# EAGLE design tenka1 (EAGLE 6.5.0)
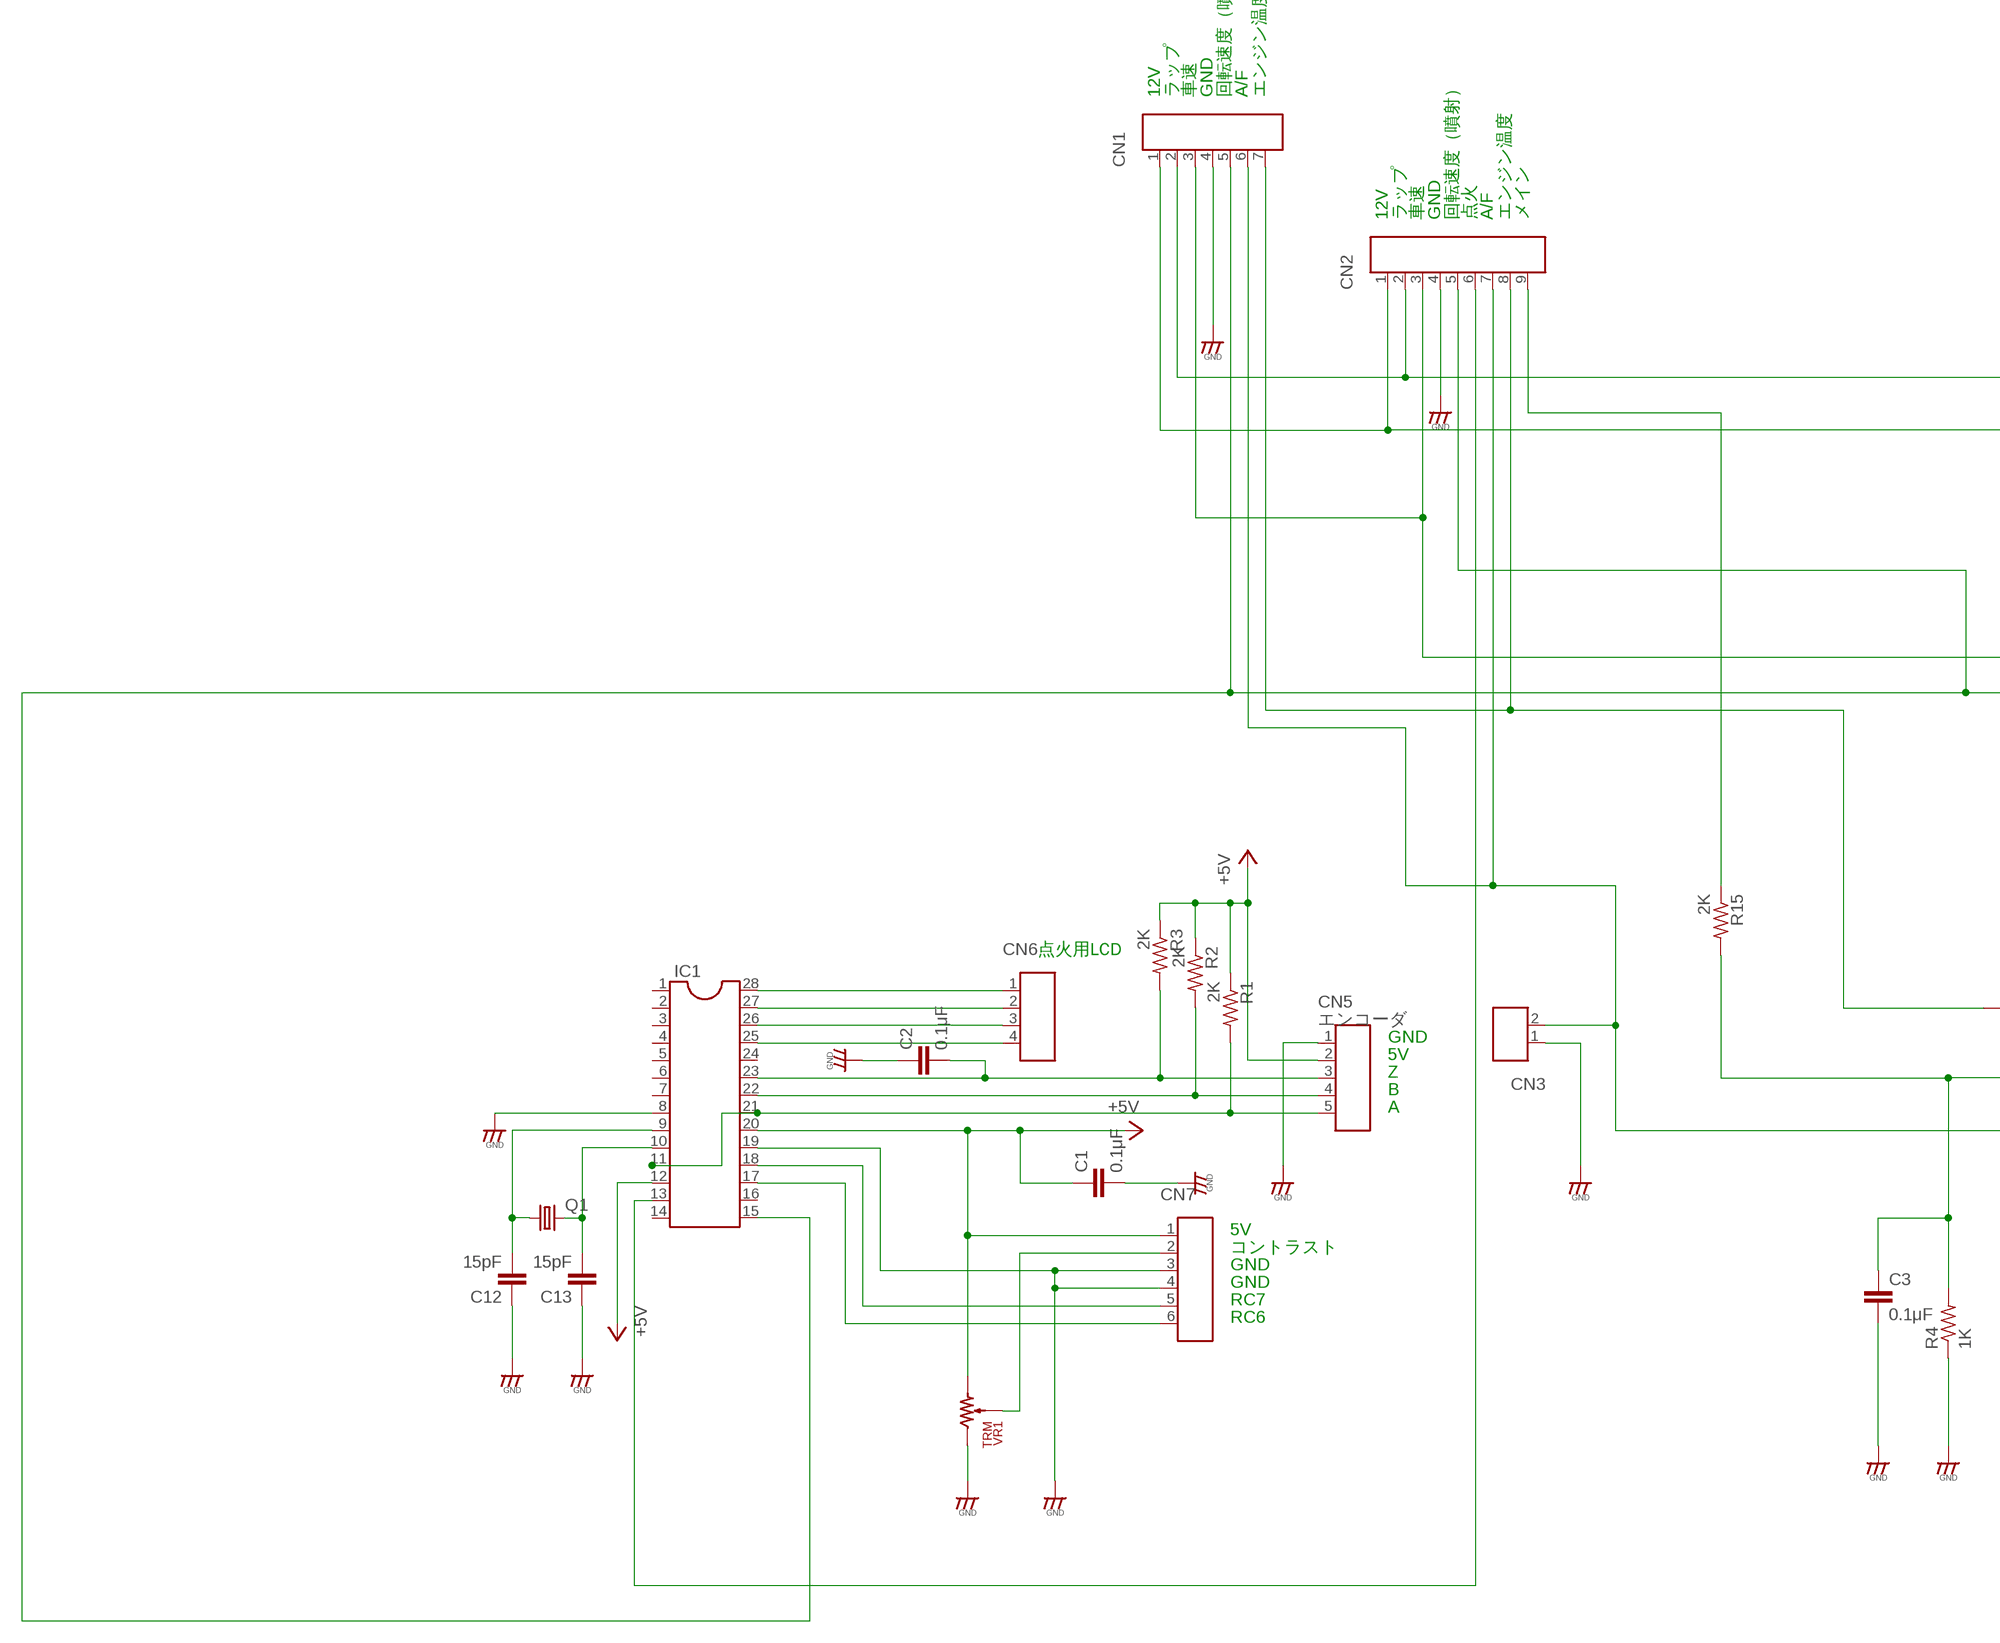
[diagram p0: schematic, sheet 1, part 1 of 2]
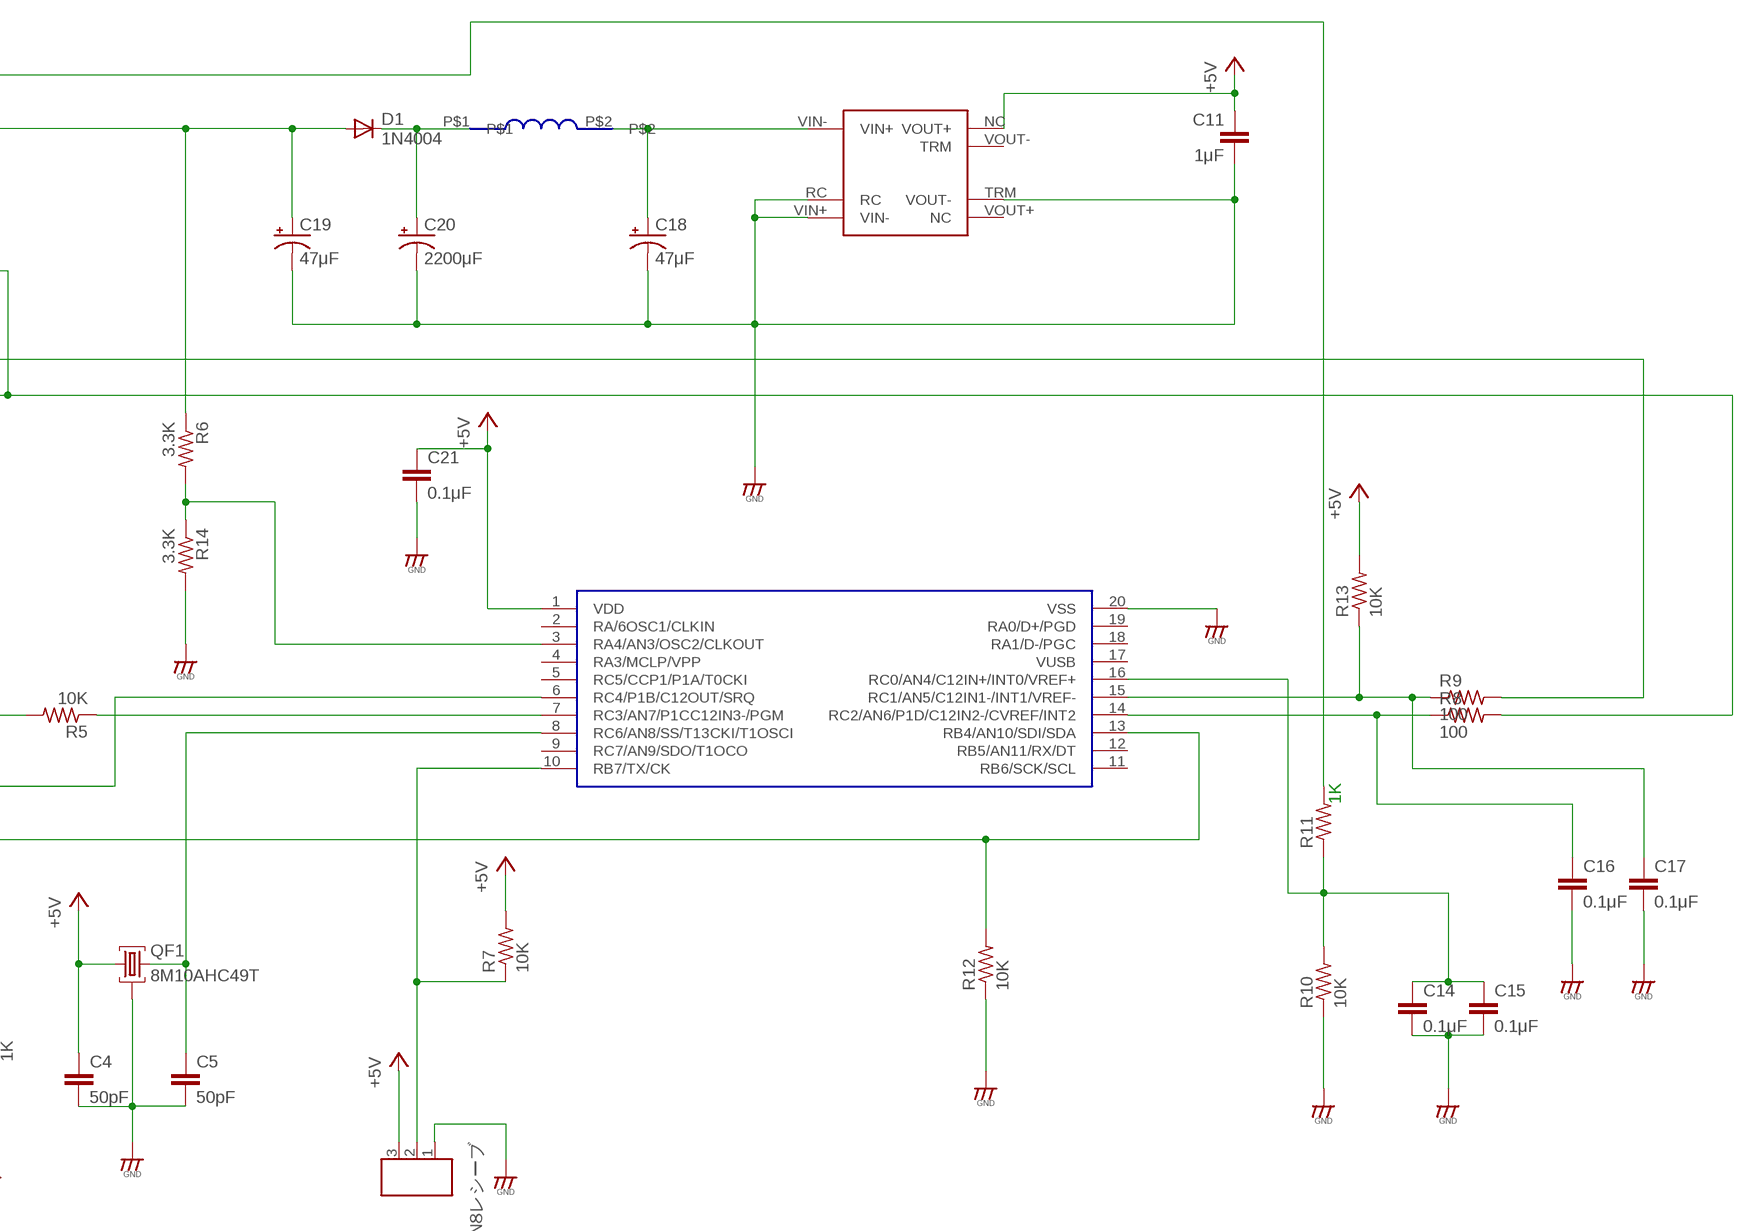
[diagram p1: schematic, sheet 1, part 2 of 2]

## Parts
18F14K50  18F14K5018F14K50  [18F14K50]
C1  0.1μF  C-EU025-024X044  [C025-024X044]
C2  0.1μF  C-EU025-024X044  [C025-024X044]
C3  0.1μF  C-EU025-024X044  [C025-024X044]
C4  50pF  C-EU025-024X044  [C025-024X044]
C5  50pF  C-EU025-024X044  [C025-024X044]
C11  1μF  C-EU025-024X044  [C025-024X044]
C12  15pF  C-EU025-024X044  [C025-024X044]
C13  15pF  C-EU025-024X044  [C025-024X044]
C14  0.1μF  C-EU025-024X044  [C025-024X044]
C15  0.1μF  C-EU025-024X044  [C025-024X044]
C16  0.1μF  C-EU025-024X044  [C025-024X044]
C17  0.1μF  C-EU025-024X044  [C025-024X044]
C18  47μF  CPOL-USE2-4  [E2-4]
C19  47μF  CPOL-USE2-4  [E2-4]
C20  2200μF  CPOL-USE5-13  [E5-13]
C21  0.1μF  C-EU025-024X044  [C025-024X044]
CN1  CON_7P  [CON_HRS_DIP_7]
CN2  CON_9P  [CON_HRS_DIP_9]
CN3  CON_2P  [CON_HRS_DIP_2]
CN5  エンコーダ  CON_5P  [CON_HRS_DIP_5]
CN6  CON_4P  [CON_HRS_DIP_4]
CN7  CON_6P  [CON_HRS_DIP_6]
CN8レシーブ  CON_3P  [CON_HRS_DIP_3]
D1  1N4004  [DO41-10]
DC2  DCDC_NEW  [DCDC_NEW]
IC1  DIL28-3  [DIL28-3]
LHL13NB101K1  LHL13NB101KLHL13NB101K  [LHL13NB101K]
Q1  CRYSTALHC49S  [HC49/S]
QF1  8M10AHC49T  [HC49U]
R1  2K  R-US_0207/7  [0207/7]
R2  2K  R-US_0207/7  [0207/7]
R3  2K  R-US_0207/7  [0207/7]
R4  1K  R-US_0207/7  [0207/7]
R5  10K  R-US_0207/7  [0207/7]
R6  3.3K  R-US_0207/7  [0207/7]
R7  10K  R-US_0207/7  [0207/7]
R8  100  R-US_0207/7  [0207/7]
R9  100  R-US_0207/7  [0207/7]
R10  10K  R-US_0207/7  [0207/7]
R11  R-US_0207/7  [0207/7]
R12  10K  R-US_0207/7  [0207/7]
R13  10K  R-US_0207/7  [0207/7]
R14  3.3K  R-US_0207/7  [0207/7]
R15  2K  R-US_0207/7  [0207/7]
VR1  TRM  [TRM]

## Nets
+5V: 18F14K50.1(VDD) C1.1 C4.1 C11.1 C21.1 CN5.2 CN7.1 CN8レシーブ.3 DC2.NC(VOUT+) IC1.12 IC1.20 QF1.1 R1.1 R2.1 R3.1 R7.2 R13.2 VR1.P$1
N$1: CN5.5 IC1.11 IC1.21 R1.2
N$2: CN2.9 R15.1
N$4: CN6.1 IC1.28
N$5: CN6.2 IC1.27
N$7: CN5.4 IC1.22 R2.2
N$9: C13.2 IC1.10 Q1.2
N$10: C12.2 IC1.9 Q1.1
N$11: CN7.5 IC1.18
N$12: CN6.3 IC1.26
N$13: CN6.4 IC1.25
N$14: CN7.6 IC1.17
N$15: CN7.2 VR1.P$2
N$16: CN1.7 CN2.8 R5.2
N$17: CN2.6 IC1.13
N$18: 18F14K50.13(RB4/AN10/SDI/SDA) CN1.6 CN2.7 CN3.2 R12.2
N$19: 18F14K50.7(RC3/AN7/P1CC12IN3-/PGM) R5.1
N$20: 18F14K50.10(RB7/TX/CK) CN8レシーブ.2 R7.1
N$21: CN1.5 CN2.5 IC1.15 R8.2
N$22: 18F14K50.8(RC6/AN8/SS/T13CKI/T1OSCI) C5.1 QF1.3
N$23: 18F14K50.6(RC4/P1B/C12OUT/SRQ) C3.1 R4.2 R15.2
N$24: CN1.3 CN2.3 R9.2
N$25: 18F14K50.15(RC1/AN5/C12IN1-/INT1/VREF-) C17.1 R9.1 R13.1
N$26: 18F14K50.14(RC2/AN6/P1D/C12IN2-/CVREF/INT2) C16.1 R8.1
N$27: 18F14K50.16(RC0/AN4/C12IN+/INT0/VREF+) C14.1 C15.1 R10.2 R11.1
N$28: 18F14K50.3(RA4/AN3/OSC2/CLKOUT) R6.2 R14.1
N$30: C18.+ DC2.VIN-(VIN+) LHL13NB101K1.P$2
N$31: CN1.2 CN2.2 R11.2
N$32: C20.+ D1.C LHL13NB101K1.P$1
N$33: C19.+ CN1.1 CN2.1 D1.A R6.1
N$79: 18F14K50.20(VSS) C1.2 C2.1 C3.2 C4.2 C5.2 C11.2 C12.1 C13.1 C14.2 C15.2 C16.2 C17.2 C18.- C19.- C20.- C21.2 CN1.4 CN2.4 CN3.1 CN5.1 CN7.3 CN7.4 CN8レシーブ.1 DC2.RC DC2.TRM(VOUT-) DC2.VIN+(VIN-) IC1.8 IC1.19 QF1.2 R4.1 R10.1 R12.1 R14.2 VR1.P$3 ; supply symbol labelled GND
N$226: C2.2 CN5.3 IC1.23 R3.2
Unconnected: 18F14K50.2(RA/6OSC1/CLKIN) 18F14K50.4(RA3/MCLP/VPP) 18F14K50.5(RC5/CCP1/P1A/T0CKI) 18F14K50.9(RC7/AN9/SDO/T1OCO) 18F14K50.11(RB6/SCK/SCL) 18F14K50.12(RB5/AN11/RX/DT) 18F14K50.17(VUSB) 18F14K50.18(RA1/D-/PGC) 18F14K50.19(RA0/D+/PGD) DC2.VOUT+(NC) DC2.VOUT-(TRM) IC1.1 IC1.2 IC1.3 IC1.4 IC1.5 IC1.6 IC1.7 IC1.14 IC1.16 IC1.24

## Notes on the sheet
- 12V | ラップ | 車速 | GND | 回転速度（噴射） | A/F | エンジン温度
- 12V | ラップ | 車速 | GND | 回転速度（噴射） | 点火 | A/F | エンジン温度 | メイン
- 点火用LCD
- GND
- 5V
- Z
- B | 1K
- A
- 5V
- コントラスト
- GND
- GND
- RC7
- RC6

## Library data of the parts
18F14K50 = 18f14k50:18F14K50: 18f14k50
C1-C5 C11-C17 C21 = rcl:C-EU: CAPACITOR, European symbol
C18-C20 = rcl:CPOL-US: POLARIZED CAPACITOR, American symbol
CN1 = da_parts:CON_7P
CN2 = da_parts:CON_9P
CN3 = da_parts:CON_2P
CN5 = da_parts:CON_5P
CN6 = da_parts:CON_4P
CN7 = da_parts:CON_6P
CN8レシーブ = da_parts:CON_3P
D1 = diode:1N4004: DIODE general purpose rectifier, 1 A
DC2 = DCDC_NEWver:DCDC_NEW: DCDC_CONVERTER
IC1 = ic-package:DIL28: Dual In Line
LHL13NB101K1 = LHL13NB101K:LHL13NB101K: LHL13NB101K
Q1 = crystal:CRYSTAL: CRYSTAL; OC_FARNELL: 1667008; OC_NEWARK: unknown
QF1 = crystal:8M10AHC49T: Monolithic Crystal Filters Source: www.vanlong.com; OC_FARNELL: unknown; OC_NEWARK: unknown
R1-R15 = rcl:R-US_: RESISTOR, American symbol
VR1 = kitpcb:TRM

## Board
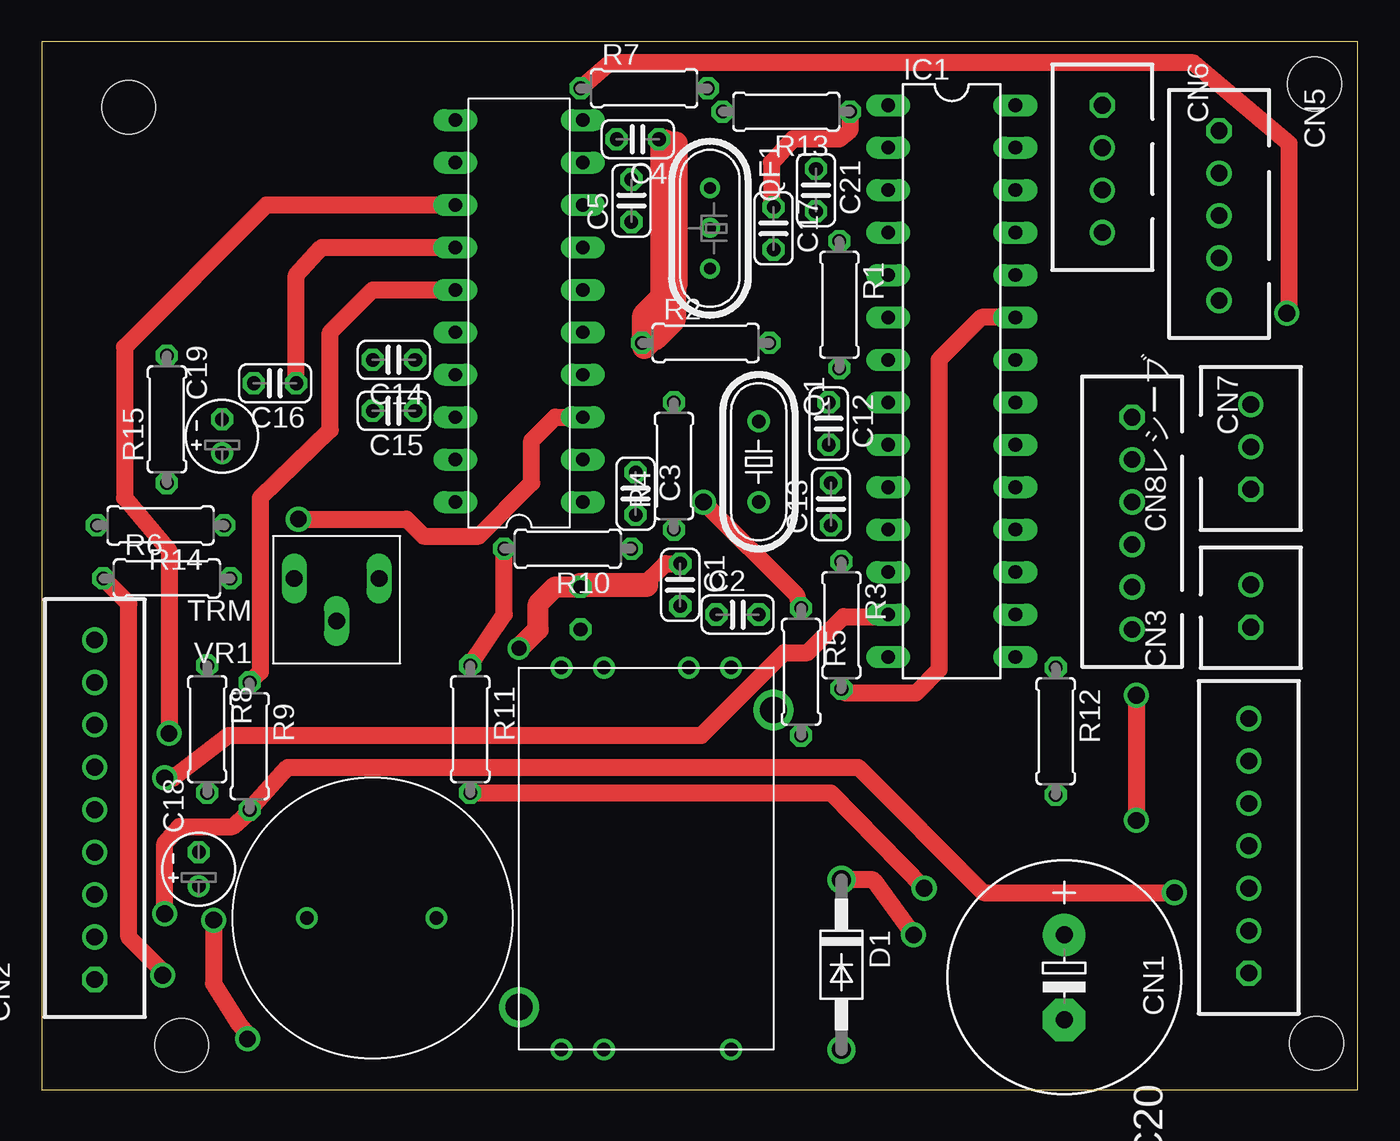
[diagram p2: board, top side]
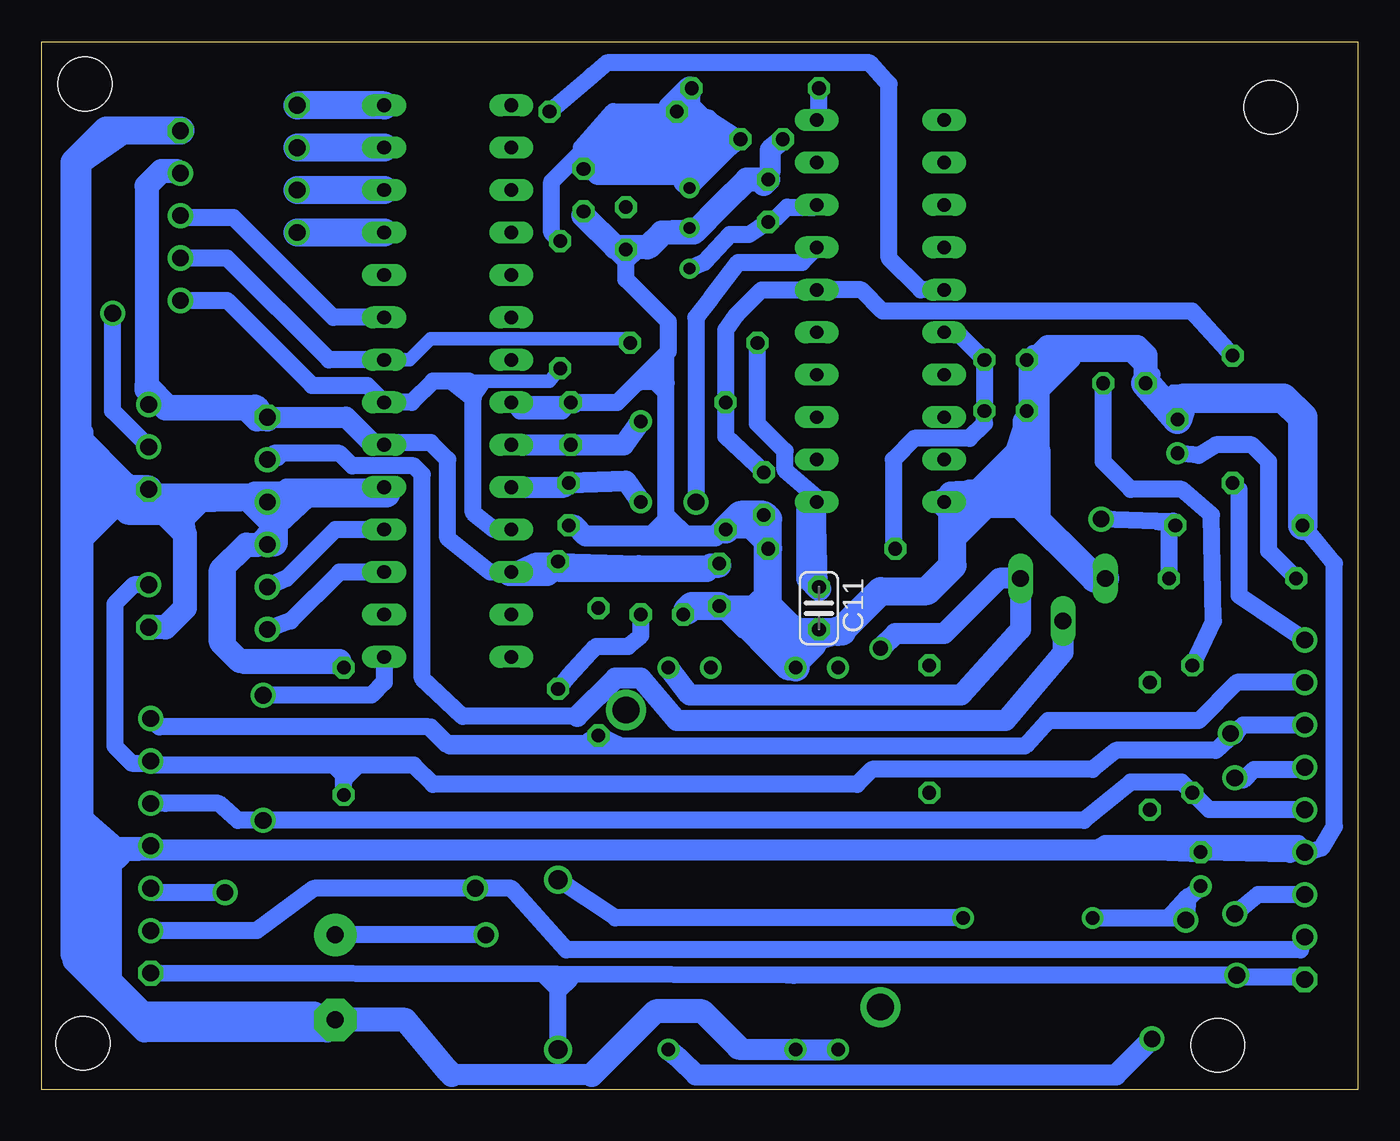
[diagram p3: board, bottom side, seen from below]

Size 78.79 x 62.73 mm. Coordinates in mm from the lower left corner, seen from the top.
Outline: 0,0 78.79,0 78.79,62.73 0,62.73 0,0
Copper layers (1*16): Top 0.035mm / dielectric 1.5mm / Bottom 0.035mm
Design rules "default": minimum track width 10mil, minimum drill 24mil, track to track 8mil, track to pad 8mil, pad to pad 8mil, via to via 8mil, smd to smd 8mil, copper to edge 40mil, drill to drill 8mil, minimum pad ring 10mil, minimum via ring 8mil, stop-mask expansion 4mil, vias tented up to drill 0mil, thermal gap 10mil
Holes 3.2 mm at 5.21,58.8 8.38,2.67 76.33,2.79 76.2,60.2

### Footprints (pad centres in the part's own frame; a part is rotated, then mirrored left to right if it is on the bottom)
18F14K50 = drill 0.8 long: 1 22.098,8.89; 2 19.558,8.89; 3 17.018,8.89; 4 14.478,8.89; 5 11.938,8.89; 6 9.398,8.89; 7 6.858,8.89; 8 4.318,8.89; 9 1.778,8.89; 10 -0.762,8.89; 11 -0.762,1.27; 12 1.778,1.27; 13 4.318,1.27; 14 6.858,1.27; 15 9.398,1.27; 16 11.938,1.27; 17 14.478,1.27; 18 17.018,1.27; 19 19.558,1.27; 20 22.098,1.27
C025-024X044 = drill 0.813 octagon: 1 -1.27,0; 2 1.27,0
E2-4 = drill 0.813 pad 1.27: + -1.016,0 | drill 0.813 pad 1.27 octagon: - 1.016,0
E5-13 = drill 1.016 pad 2.54: + -2.54,0 | drill 1.016 pad 2.54 octagon: - 2.54,0
CON_HRS_DIP_7 = drill 1 octagon: 1 -7.62,0 | drill 1: 2 -5.08,0; 3 -2.54,0; 4 0,0; 5 2.54,0; 6 5.08,0; 7 7.62,0
CON_HRS_DIP_9 = drill 1 octagon: 1 -10.16,0 | drill 1: 2 -7.62,0; 3 -5.08,0; 4 -2.54,0; 5 0,0; 6 2.54,0; 7 5.08,0; 8 7.62,0; 9 10.16,0
CON_HRS_DIP_2 = drill 1 octagon: 1 -1.27,0 | drill 1: 2 1.27,0
CON_HRS_DIP_5 = drill 1 octagon: 1 -5.08,0 | drill 1: 2 -2.54,0; 3 0,0; 4 2.54,0; 5 5.08,0
CON_HRS_DIP_4 = drill 1 octagon: 1 -3.81,0 | drill 1: 2 -1.27,0; 3 1.27,0; 4 3.81,0
CON_HRS_DIP_6 = drill 1 octagon: 1 -6.35,0 | drill 1: 2 -3.81,0; 3 -1.27,0; 4 1.27,0; 5 3.81,0; 6 6.35,0
CON_HRS_DIP_3 = drill 1 octagon: 1 -2.54,0 | drill 1: 2 0,0; 3 2.54,0
DO41-10 = drill 1.118: A 5.08,0; C -5.08,0
DCDC_NEW = drill 0.8: NC 11.43,24.13; RC 3.81,1.27; TRM 3.81,24.13; VIN+ 1.27,1.27; VIN- 11.43,1.27; VOUT+ 1.27,24.13; VOUT- 8.89,24.13 | drill 1.6: P$8 13.97,21.59; P$9 -1.27,3.81
DIL28-3 = drill 0.813 long: 1 -16.51,-3.81; 2 -13.97,-3.81; 3 -11.43,-3.81; 4 -8.89,-3.81; 5 -6.35,-3.81; 6 -3.81,-3.81; 7 -1.27,-3.81; 8 1.27,-3.81; 9 3.81,-3.81; 10 6.35,-3.81; 11 8.89,-3.81; 12 11.43,-3.81; 13 13.97,-3.81; 14 16.51,-3.81; 15 16.51,3.81; 16 13.97,3.81; 17 11.43,3.81; 18 8.89,3.81; 19 6.35,3.81; 20 3.81,3.81; 21 1.27,3.81; 22 -1.27,3.81; 23 -3.81,3.81; 24 -6.35,3.81; 25 -8.89,3.81; 26 -11.43,3.81; 27 -13.97,3.81; 28 -16.51,3.81
LHL13NB101K = drill 0.8: P$1 0,0; P$2 0,7.747
HC49/S = drill 0.813: 1 -2.413,0; 2 2.413,0
HC49U = drill 0.7 pad 1.2: 1 -2.413,0; 2 -0.027,0; 3 2.413,0
0207/7 = drill 0.813 octagon: 1 -3.81,0; 2 3.81,0
TRM = drill 1 long: P$1 0,0; P$2 2.54,2.54; P$3 5.08,0

### Placement (x,y rotation side)
18F14K50  23.5,57.28 270 top
C1  38.23,30.23 270 top
C2  41.66,28.45 0 top
C3  35.56,35.69 270 top
C4  35.69,56.9 180 top
C5  35.31,53.21 90 top
C11  32.26,28.83 270 bottom
C12  47.12,39.88 270 top
C13  47.24,35.05 90 top
C14  21.08,43.69 180 top
C15  21.08,40.64 180 top
C16  13.97,42.29 180 top
C17  43.81,51.56 270 top
C18  9.4,13.21 90 top
C19  10.79,39.12 90 top
C20  61.21,6.73 270 top
C21  46.35,53.85 270 top
CN1  72.26,14.61 90 top
CN2  3.17,16.76 90 top
CN3  72.39,28.96 90 top
CN5  70.48,52.32 270 top
CN6  63.5,55.12 270 top
CN7  65.28,33.91 270 top
CN8レシーブ  72.39,38.48 90 top
D1  47.88,7.49 270 top
DC2  29.84,1.14 0 top
IC1  54.48,42.42 270 top
LHL13NB101K1  23.62,10.29 90 top
Q1  42.93,37.59 270 top
QF1  40.01,51.56 270 top
R1  47.75,46.99 270 top
R2  39.75,44.7 0 top
R3  47.88,27.81 270 top
R4  37.85,37.34 90 top
R5  45.47,25.02 270 top
R6  7.49,30.61 0 top
R7  36.07,59.94 0 top
R8  9.91,21.59 270 top
R9  12.45,20.57 270 top
R10  31.5,32.38 180 top
R11  25.65,21.59 270 top
R12  60.71,21.46 270 top
R13  44.58,58.55 180 top
R14  7.11,33.78 180 top
R15  7.49,40.13 90 top
VR1  20.19,30.61 180 top

### Tracks (layer width: path | path; a pad name or v marks a point on that pad's centre or on a via)
+5V  (via drill 0.9)
  Top 1.016: R2.1 36.96,46.74 C4.1 | C11.1 35.94,30.1 37.34,31.5 C1.1
  Top 1.27: v28.57,26.42 29.72,27.56 29.72,29.08 30.73,30.1 C11.1
  Bottom 1.016: C11.1 18F14K50.1 32.38,35.43 34.29,37.08 34.29,38.23 35.94,39.88 R2.1 | R13.2 38.73,58.04 | 38.73,58.04 C4.1 37.72,56.26 QF1.1 | C1.1 43.05,31.5 R3.1 49.28,31.62 IC1.12 51.94,30.99 54.48,33.02 54.48,37.72 55.5,38.73 58.17,38.73 IC1.20 58.42,38.48 58.8,38.61 60.45,40.26 CN7.1 65.79,41.02 71.25,41.02 | 38.73,58.04 37.85,57.15 | CN5.2 71.88,54.86 72.39,54.1 CN8レシーブ.3 71.25,41.02 | 71.25,41.02 72.26,42.04 | R1.1 48.26,51.31 48.26,54.36 46.48,56.13 | 46.99,55.63 C21.1 46.48,56.13 | 46.48,56.13 46.48,56.39 44.58,58.55 R13.2 | R7.2 39.88,58.8 R13.2
  Bottom 1.27: 65.02,40.26 60.58,40.26 58.93,38.61 58.8,38.61 IC1.20 58.04,38.61 | DC2.NC 40.01,23.62 23.75,23.62 20.19,27.56 VR1.P$1 21.46,30.61 24.77,27.3 27.69,27.3 v28.57,26.42
N$1
  Bottom 0.813: R1.2 48.39,42.42 52.78,42.42 53.11,42.22
  Bottom 1.016: IC1.11 51.69,33.53 52.96,34.54 52.96,41.4 | 52.96,41.4 52.96,41.53 | 52.96,41.53 52.96,41.91 53.11,42.22 53.21,42.42 55.37,42.42 56.64,41.15 IC1.21 59.31,42.16 62.61,42.16 67.69,47.24 CN5.5 | 52.96,41.4 54.1,42.29 | 52.96,41.53 52.45,42.29
N$2
  Bottom 1.016: R15.1 7.11,35.94 7.11,29.59 CN2.9
N$4
  Bottom 0.406: IC1.28 58.17,58.93 58.17,59.05
  Bottom 1.676: IC1.28 CN6.1
N$5
  Bottom 1.676: IC1.27 CN6.2
N$7
  Bottom 0.813: IC1.22 56.77,43.69 55.5,44.96 43.81,44.96 R2.2
  Bottom 1.016: IC1.22 61.59,43.69 67.69,49.78 CN5.4
N$9
  Bottom 1.27: IC1.10 47.5,36.07 C13.2 43.81,36.45 Q1.2
N$10
  Bottom 1.27: IC1.9 C12.2 43.94,38.61 Q1.1
N$11
  Bottom 1.016: IC1.18 61.21,33.53 64.14,30.61 CN7.5
N$12
  Bottom 1.676: IC1.26 CN6.3
N$13
  Bottom 1.676: IC1.25 CN6.4
N$14
  Bottom 1.016: IC1.17 60.96,30.99 63.88,28.07 CN7.6
N$15
  Bottom 0.813: 65.02,37.97 CN7.2
  Bottom 1.016: 64.64,37.85 CN7.2 64.9,38.1 60.96,38.1 60.2,37.34 56.52,37.34 56.01,36.83 56.01,24.64 53.59,22.35 46.74,22.35
  Bottom 1.27: VR1.P$2 17.65,26.16 21.08,22.1 40.77,22.1 42.93,24.64 44.45,24.64 46.74,22.35
N$16
  Bottom 1.016: CN2.8 7.24,24.38 9.53,22.1 18.54,22.1 19.94,20.57 42.93,20.57 44.07,20.57 | 44.07,20.57 R5.2 46.1,20.83 46.23,20.7 54.61,20.7 55.63,21.72 71.75,21.72 CN1.7 | 44.07,20.57 54.36,20.57 55.5,21.72
N$17  (via drill 1)
  Top 1.016: v7.37,18.67 7.87,18.67 11.18,21.21 39.5,21.21 44.45,26.16 45.85,26.16 48.01,28.32 50.55,28.32 IC1.13
  Bottom 1.016: v7.37,18.67 6.86,18.54 6.22,19.18 3.3,19.18 CN2.6
N$18  (via drill 1)
  Top 1.016: v7.62,21.34 7.62,32.26 4.95,35.43 4.95,44.45 13.46,52.96 18F14K50.13
  Bottom 0.813: 60.71,18.41 59.82,19.3 | 60.71,18.54 60.71,18.67 61.47,19.43
  Bottom 1.016: 7.04,21.67 8.51,20.32 14.48,20.32 15.88,19.18 29.08,19.18 29.97,18.29 55.37,18.29 56.52,19.43 60.83,19.43 | 7.04,21.67 6.86,21.84 CN2.7 | 60.83,19.43 61.47,19.43 72.01,19.43 CN1.6 72.39,19.56 73.41,19.56 74.42,20.57 74.42,29.08 73.28,30.23 CN3.2 | R12.2 60.71,18.41 60.71,18.54 60.71,19.3 60.83,19.43 | v7.62,21.34 7.34,21.21 7.04,21.67
N$19  (via drill 1)
  Top 1.016: R5.1 45.21,29.59 v39.62,35.18
  Bottom 1.016: v39.62,35.18 39.62,46.23 38.73,47.37 37.08,49.53 33.27,49.53 18F14K50.7
N$20  (via drill 1)
  Top 1.016: R7.1 34.04,61.47 68.96,61.47 74.68,56.64 74.68,46.61 v74.55,46.48
  Bottom 1.016: CN8レシーブ.2 74.55,40.64 v74.55,46.48 | 18F14K50.10 32.26,58.17 R7.1
N$21  (via drill 1)
  Top 1.016: v65.53,23.62 v65.53,16.13
  Bottom 1.016: 71.37,17.14 CN1.5 68.2,17.14 67.06,16.13 v65.53,16.13 16.38,16.13 13.59,18.41 10.54,18.41 R8.2 8.89,16.76 CN2.5 | IC1.15 58.29,24.38 59.05,23.62 v65.53,23.62
N$22
  Bottom 1.016: 18F14K50.8 32.51,52.83 34.16,52.83 34.8,52.2 C5.1 36.45,51.18 37.59,51.18 39.12,49.53 QF1.3
N$23
  Bottom 1.016: C3.1 37.85,39.12 R4.2 37.85,45.47 37.21,46.35 35.69,47.88 18F14K50.6 29.72,47.88 28.45,46.61 9.91,46.61 R15.2
N$24  (via drill 1)
  Top 1.016: v7.37,10.54 7.37,14.73 8.26,15.75 11.43,15.75 12.57,16.76 R9.2 14.73,19.3 48.9,19.3 56.39,11.81 v67.82,11.81 67.94,11.81
  Bottom 1.016: CN2.3 5.97,11.68 v7.37,10.54 | v67.82,11.81 72.01,11.81 CN1.3
N$25
  Top 1.016: 18F14K50.15 19.81,47.88 17.27,45.34 17.27,39.5 13.08,35.43 13.08,25.02 R9.1 | R13.1 48.39,57.4 47.75,56.9 44.96,56.9 43.69,55.5 43.69,52.96 C17.1
  Bottom 1.016: 18F14K50.15 26.16,47.88 28.07,49.78 28.07,60.2 29.21,61.47 44.96,61.47 45.85,60.71 R13.1
N$26
  Top 1.016: C16.1 15.24,48.77 16.76,50.42 18F14K50.14
  Bottom 1.016: R8.1 8.64,28.07 8.76,34.42 10.54,35.94 13.59,35.94 15.24,37.59 C16.1
N$27
  Top 1.016: R11.1 27.69,28.45 R10.2
  Bottom 1.016: 18F14K50.16 24,45.34 C14.1 C15.1 22.35,39.88 23.24,38.99 26.54,38.99 27.81,37.72 27.81,32.38 R10.2
N$28  (via drill 1)
  Top 1.016: 18F14K50.3 30.73,40.26 29.34,38.86 29.34,36.32 26.16,33.15 22.86,33.15 21.84,34.16 v15.37,34.16
  Bottom 1.016: 12.06,34.04 v15.37,34.16 14.86,34.16 | 11.3,33.91 R14.1 11.05,34.04 12.06,34.04 | 12.06,34.04 11.3,33.91 | 11.3,33.91 R6.2
N$30  (via drill 1)
  Top 1.016: v10.29,10.16 10.29,6.35 11.81,3.94 12.45,3.17 v12.32,3.05
  Bottom 1.016: C18.+ 10.16,11.43 v10.29,10.16 10.67,10.29 11.3,10.29 | LHL13NB101K1.P$2 11.3,10.29 | 11.3,10.29 10.16,11.56
  Bottom 1.27: v12.32,3.05 14.48,0.89 39.62,0.89 40.64,1.91 DC2.VIN-
N$31  (via drill 1)
  Top 1.016: R11.2 47.24,17.78 v52.83,12.06
  Bottom 1.016: CN2.2 3.43,8.38 47.37,8.38 50.67,12.06 v52.83,12.06 62.48,12.06 65.91,9.53 CN1.2
N$32  (via drill 1)
  Top 1.016: D1.C 49.78,12.57 v52.2,9.27
  Bottom 1.016: LHL13NB101K1.P$1 44.45,10.29 D1.C | v52.2,9.27 C20.+
N$33  (via drill 1)
  Top 1.016: v7.24,6.86 7.24,7.11 5.21,9.14 5.21,29.08 R6.1
  Bottom 1.016: CN2.1 3.3,6.73 7.11,6.73 v7.24,6.86 33.78,6.86 34.16,6.86 47.88,6.91 | 47.88,6.91 CN1.1 | R6.1 5.33,32.26 5.33,37.59 6.35,38.61 8.51,38.61 9.53,37.97 C19.+ | D1.A 47.88,6.91
N$37
  Bottom 0.305: 8.76,42.04 11.18,42.04
N$39
  Bottom 0.305: 24.13,35.69 24.38,35.69
  Bottom 1.016: 19.18,38.35 18.92,38.35 18.92,34.04
  Bottom 1.422: 24.38,35.69 21.08,35.69 | 21.08,35.69 20.95,35.69 19.94,36.7 19.94,40.01 19.81,40.13 | 19.18,43.56 19.18,38.35 19.18,37.47 21.08,35.69
N$40
  Bottom 1.422: 23.24,35.81 22.73,35.81 20.07,38.48
N$41
  Bottom 1.422: 19.3,41.02 19.3,41.78 17.27,43.81
N$43
  Bottom 1.422: 63.75,35.56 63.75,35.69 63.63,35.81
N$44
  Bottom 0.406: 63.12,35.18 63.37,35.18 64.39,34.16
N$46
  Bottom 1.016: 64.52,33.78 62.87,35.31
N$47
  Bottom 1.016: 37.97,57.15 37.97,56.01
N$51
  Bottom 1.016: 70.23,34.04 69.34,34.92
N$52
  Bottom 1.422: 60.96,25.65 66.93,25.65 68.07,26.8 68.07,31.11 66.55,32.64 65.79,32.64 65.28,33.15
N$54
  Bottom 0.61: 74.8,13.46 74.8,14.48 75.06,14.73
N$57
  Bottom 1.016: 33.78,27.81 33.78,27.94 35.18,29.34 35.43,29.34 35.81,28.96 36.07,28.96 35.43,28.32 36.58,28.32 36.83,28.57
N$58
  Bottom 1.016: 38.23,29.08 36.2,29.08 35.43,29.84
N$60
  Bottom 1.016: 38.86,58.17 39.12,58.17 39.75,58.8
N$61
  Bottom 0.406: 43.69,49.4 43.56,49.4 42.93,50.04
N$62
  Bottom 0.406: 44.07,49.4 44.58,49.91
N$63
  Bottom 0.61: 41.91,42.16 42.93,42.16 43.05,42.29
N$64
  Bottom 0.61: 47.88,5.97 48.13,5.97 48.9,6.73
N$65
  Bottom 0.61: 47.88,5.84 47.62,5.84 46.99,6.48
N$66
  Bottom 1.422: 70.74,54.99 71.63,54.99 72.52,54.1 72.52,42.16 71.25,40.89 66.04,40.89 65.28,40.13 65.91,40.13 66.55,40.77 71.37,40.77 72.52,41.91
N$67
  Bottom 1.016: 50.42,41.02 46.86,41.02
N$68
  Bottom 1.016: 19.68,35.05 19.68,37.21
N$69
  Bottom 1.422: 47.88,31.5 48.51,30.86 50.8,30.86
N$70
  Bottom 1.422: 47.88,31.24 47.75,31.11 38.99,31.11 38.73,31.37 38.23,31.37
N$71
  Bottom 1.422: 32.26,29.97 32.89,30.61 32.89,35.05
N$73
  Bottom 1.422: 12.7,42.93 12.7,43.94 13.21,44.45 18.54,44.45 19.3,43.69
N$75
  Top 1.422: 32.26,30.23 36.2,30.23
N$76
  Bottom 1.422: 40.26,54.36 40.26,54.99 38.23,57.02 39.37,57.02 40.39,58.04 40.39,54.99 39.88,54.48 39.88,54.86 | 39.88,54.86 39.88,56.26 41.78,58.17 43.43,58.17 46.1,55.5 45.34,55.5 43.31,57.53 42.04,57.53 40.64,56.13 40.64,56.26 41.27,56.9 44.07,56.9 45.59,55.37 44.32,55.37 43.56,56.13 41.15,56.13 39.88,54.86 | 39.88,54.86 45.47,54.86 45.72,55.12
N$77
  Top 1.422: 37.34,56.77 37.34,45.72 36.07,44.45 36.07,46.35 37.97,48.26 37.97,56.64 37.85,56.52 37.85,46.1 36.7,44.96 36.2,44.96
N$78
  Bottom 1.422: 40.01,59.82 40.01,59.94 41.15,58.8 41.15,58.42
N$79
  Bottom 0: IC1.19 63.88,36.07 64.9,35.05 72.26,35.05 72.9,35.69 73.91,35.69 75.18,35.69 76.2,34.67 | 76.2,16.26 74.17,14.22 16,14.22 3.43,14.22 3.3,14.1
  Bottom 0.61: 41.4,42.29 41.66,42.29 42.29,42.93 42.93,42.29 42.29,42.29 41.66,41.66
  Bottom 0.813: 24.26,33.4 23.88,33.4 22.48,34.8
  Bottom 1.016: 3.3,14.22 3.56,14.73 8.51,14.73 | 8.51,14.73 6.48,14.35 | 35.43,32.38 35.43,32.51 36.83,33.91 37.47,33.91 R4.1 | 36.18,27.52 35.31,28.19 | 37.97,33.66 R4.1 | IC1.19 64.14,36.07 CN7.3 | CN7.3 64.9,32.77 CN7.4 66.29,32.64 67.69,31.24 67.69,26.67 66.67,25.4 60.58,25.4 R12.1 | 35.18,56.26 C5.2 | 72.77,14.22 72.64,14.22 72.52,14.35 | IC1.8 50.16,40.64 47.62,40.64 C12.1 44.32,41.15 41.4,44.07 | CN2.4 4.06,14.1 C18.- | 18F14K50.20 24,35.94 21.34,35.94 C15.2 C14.2 19.43,44.07 13.59,44.07 12.32,42.8 C16.2 | C2.1 39.62,28.7 C1.2 36.79,27.52 34.92,27.52 | 74.8,36.07 76.33,37.59 76.33,55.37 73.41,57.4 CN5.1 | 74.8,36.07 74.68,35.94 CN8レシーブ.1 | CN8レシーブ.1 71.5,35.05 CN7.3 | CN8レシーブ.1 70.1,33.66 | 76.2,34.67 76.2,16.26 74.3,14.61 CN1.4 72.9,14.22 73.79,14.22 74.8,13.21 74.8,14.99 74.93,15.11 | 76.2,34.67 74.8,36.07 | C20.- 62.48,4.45 | 3.3,14.1 2.16,14.48 1.4,15.75 1.4,31.5 R14.2 | 70.1,33.66 70.1,28.7 71.12,27.69 71.37,27.69 | 72.26,27.69 CN3.1 | 70.1,33.66 70.1,34.8 | 76.2,34.67 76.2,39.37 | C11.2 32.3,27.52 33.27,27.52 | C17.2 42.29,50.29 41.02,51.56 40.03,51.56 QF1.2 39.98,51.56 39.5,51.56 38.1,52.96 | C21.2 46.35,52.32 46.35,52.2 44.45,50.29 C17.2 | 41.4,44.07 41.27,44.2 41.27,45.97 43.81,48.51 C17.2 | 41.4,34.16 41.4,33.78 41.27,33.66 41.27,33.15 | 41.4,34.16 41.4,42.29 41.4,44.07 | 42.42,33.15 41.4,34.16 | 40.26,33.15 40.26,33.27 41.15,34.16 | 75.69,35.31 75.69,35.94 75.69,36.7 | R4.1 35.94,33.53 | 8.51,14.73 15.11,14.73 16,14.22
  Bottom 1.27: C4.2 35.18,56.26 35.18,54.99 | C18.- 12.06,14.35 72.52,14.35 CN1.4 | 37.97,33.66 38.48,33.15 40.26,33.15 41.27,33.15 42.42,33.15 46.23,33.15 46.86,33.78 C13.1 | 45.85,0.89 54.23,0.89 | DC2.VIN+ DC2.RC 36.96,2.41 37.08,2.54
  Bottom 1.422: 65.41,35.56 73.79,35.56 73.91,35.43 73.91,34.8 73.66,34.54 71.5,34.54 70.23,33.27 70.23,28.83 71.37,27.69 72.26,27.69 | 31.24,27.43 31.33,27.52 33.27,27.52 34.92,27.52 36.18,27.52 | 35.56,54.23 C5.2 36.58,54.48 38.1,52.96 39.75,51.31 41.66,51.31 42.55,50.42 44.45,50.42 46.35,52.32 | 63.37,35.69 66.04,35.69 66.29,35.43 | 54.23,0.89 54.48,1.14 57.02,4.19 C20.- | 37.08,2.54 39.24,4.7 42.04,4.7 45.85,0.89
  Bottom 1.676: 58.17,35.69 63.37,35.69 64.14,35.69 64.9,34.92 64.9,32.77 | VR1.P$3 15.75,30.61 20.19,35.05 24.64,35.05 18F14K50.20 24.26,34.67 24.26,33.4 24.26,31.37 25.78,29.84 28.57,29.84 30.99,27.43 31.24,27.43 | R4.1 36.96,34.42 C3.2 35.31,34.16 R10.1 35.31,28.19 35.31,26.92 DC2.TRM | 62.48,4.45 72.77,4.45 74.8,6.48 74.8,13.59 74.17,14.22 | CN5.1 74.93,57.4 76.83,55.5 76.83,8.13 73.28,4.57 73.28,4.7 75.95,7.37 75.95,14.99 76.2,15.24 | CN8レシーブ.1 75.69,35.94 | 76.71,32 76.71,32.89 73.91,35.69 73.91,36.2 76.71,38.99 | C1.2 39.88,28.96 40.13,28.7
  Bottom 1.778: R14.2 3.3,40.26 4.45,41.4 10.41,41.4 C19.- C16.2
N$80
  Bottom 1.422: 64.77,34.16 65.28,34.16 66.42,35.31
N$81
  Bottom 1.422: 61.72,3.56 72.64,3.56 76.83,7.75 76.83,9.02 76.45,9.4
N$82
  Bottom 1.676: 30.86,27.43 30.86,27.56 32.64,27.05 | 32.64,27.05 34.29,27.05 | 33.66,25.65 32.64,26.67 32.64,27.05
N$83
  Bottom 1.27: 34.67,26.04 37.34,28.7 37.72,28.7 34.16,25.15 33.66,25.15
N$84
  Bottom 1.016: 24,32.26 24,32.89 21.97,34.92
N$226
  Top 1.016: IC1.23 56.26,46.23 53.72,43.69 53.72,25.15 52.32,23.75 48.13,23.75 R3.2
  Bottom 1.016: IC1.23 61.34,46.23 67.31,52.2 70.36,52.2 CN5.3 | R3.2 47.24,24.77 45.59,26.54 43.69,26.54 42.93,27.18 C2.2